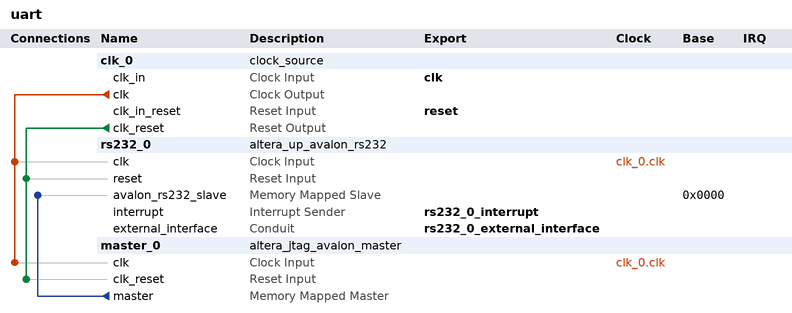
[diagram p0: system contents]
# Platform Designer (Qsys) system uart, Arria 10 10AS066H2F34I1HG
# Parameters at their usual value, and those the tool derives, are not listed.
package require -exact qsys 1.0
create_system uart
set_project_property DEVICE_FAMILY {Arria 10}
set_project_property DEVICE 10AS066H2F34I1HG

add_component clk_0 uart_clk_0.ip clock_source clk_0 

add_component rs232_0 uart_rs232_0.ip altera_up_avalon_rs232 rs232_0 18.0

add_component master_0 uart_master_0.ip altera_jtag_avalon_master master_0 19.1

# connections
add_connection clk_0.clk master_0.clk clock
add_connection clk_0.clk rs232_0.clk clock
add_connection clk_0.clk_reset master_0.clk_reset reset
add_connection clk_0.clk_reset rs232_0.reset reset
add_connection master_0.master rs232_0.avalon_rs232_slave avalon
set_connection_parameter_value master_0.master/rs232_0.avalon_rs232_slave baseAddress 0x0000

# exported interfaces
add_interface clk clock sink
set_interface_property clk EXPORT_OF clk_0.clk_in
add_interface reset reset sink
set_interface_property reset EXPORT_OF clk_0.clk_in_reset
add_interface rs232_0_external_interface conduit end
set_interface_property rs232_0_external_interface EXPORT_OF rs232_0.external_interface
add_interface rs232_0_interrupt interrupt sender
set_interface_property rs232_0_interrupt EXPORT_OF rs232_0.interrupt

save_system uart.qsys
